# Altium schematic sheet Э4_2_New.SchDoc
size 420 x 297 mm; DocumentNumber: АЕСН.464512.002Э4; SheetNumber: 2; SheetTotal: 2
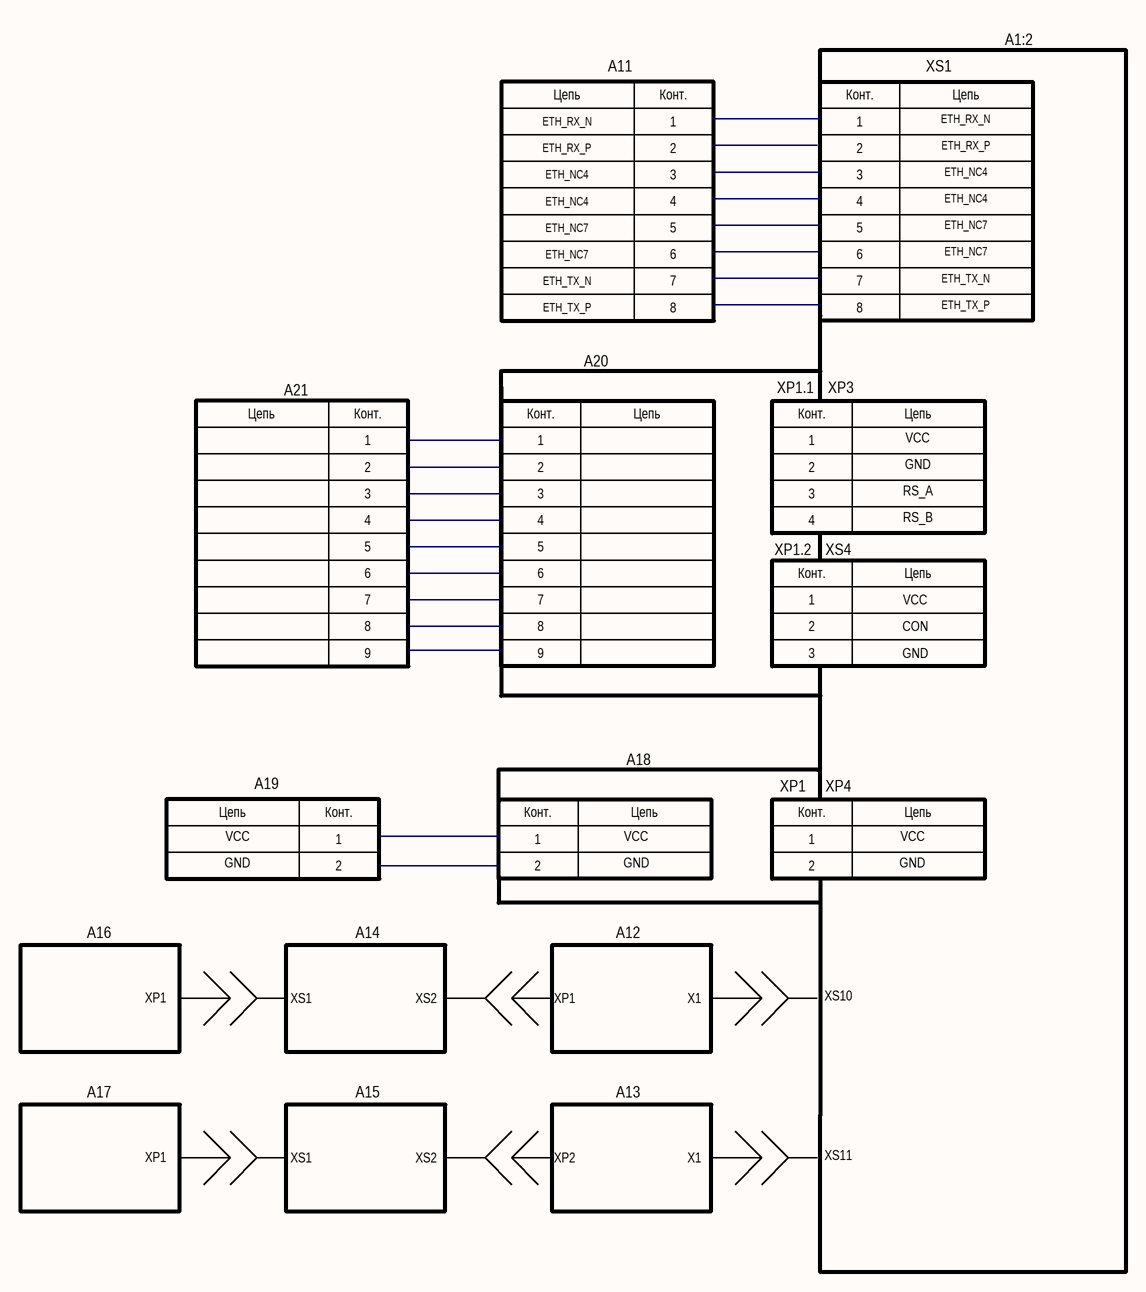
[diagram p0: Э4_2_New.SchDoc]

## Parts
(Parts that share a designator on the sheet are numbered #1, #2 ... from top to bottom, then left to right.)
*#1  9pin  (value not drawn)
*#2  9pin  (value not drawn)
*#3  3pin  (value not drawn)
*#4  2pin  (value not drawn)
*?#1  2pin  (value not drawn)
*?#2  2pin  (value not drawn)
?  8pin  (value not drawn)
A11  8pin  (value not drawn)
X?  4pin_con  (value not drawn)

## Notes on the sheet
- A1:2
- ETH_RX_N
- A11
- XS1
- ETH_RX_P
- (near A11) ETH_NC4
- ETH_NC4
- (near A11) ETH_NC7
- ETH_NC7
- ETH_TX_N
- ETH_TX_P
- A21
- A20
- (near X?) XP1.1
- XP3
- VCC
- GND
- RS_A
- RS_B
- XP1.2
- XS4
- (near *#3) VCC
- (near *#3) CON
- (near *#3) GND
- A19
- A18
- XP1
- XP4
- (near *#4) VCC
- (near *#4) GND
- (near *?#1) VCC
- (near *?#1) GND
- (near *?#2) VCC
- (near *?#2) GND
- A16
- A14
- A12
- XS2
- X1
- XS10
- A17
- A15
- A13
- XP2
- XS11
- Подп. и дата
- Инв.№ дубл.
- Взам. инв. №
- Инв № подл.
- Изм.
- Лист
- № докум.
- Подп.
- Дата
- Копировал
- Формат А3
- (in symbol 2pin) Цепь; Конт.; 1; 2
- (in symbol 3pin) Конт.; Цепь; 1; 2; 3
- (in symbol 4pin_con) Конт.; Цепь; 1; 2; 3; 4
- (in symbol 8pin) Цепь; Конт.; 1; 2; 3; 4; 5; 6; 7; 8
- (in symbol 9pin) Цепь; Конт.; 1; 2; 3; 4; 5; 6; 7; 8; 9